# EAGLE schematic C1316G (EAGLE 6.6.0)
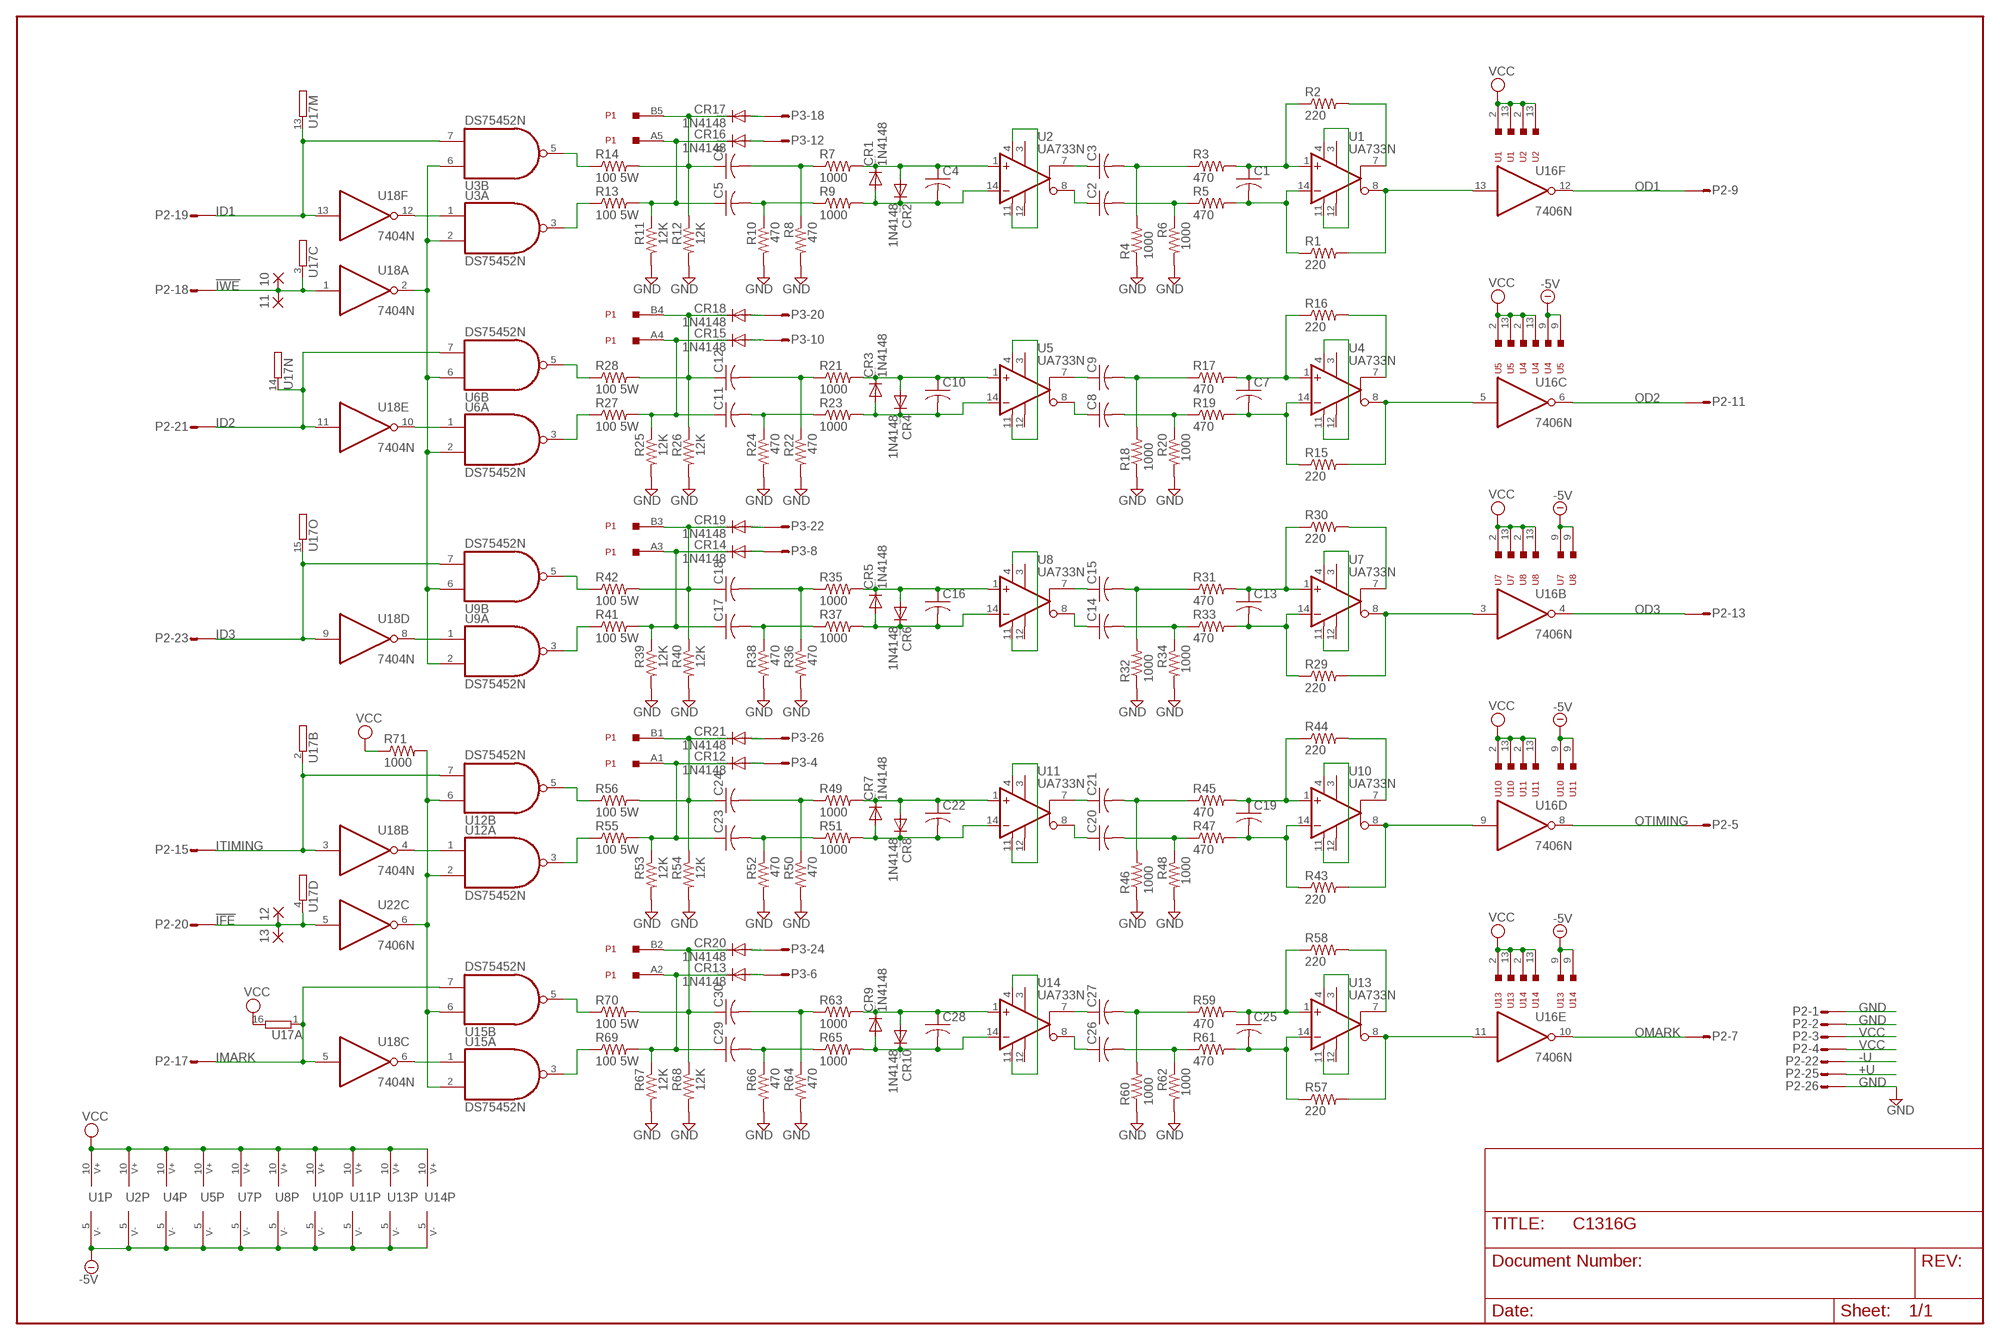
[diagram p0: schematic, sheet 1, part 1 of 2]
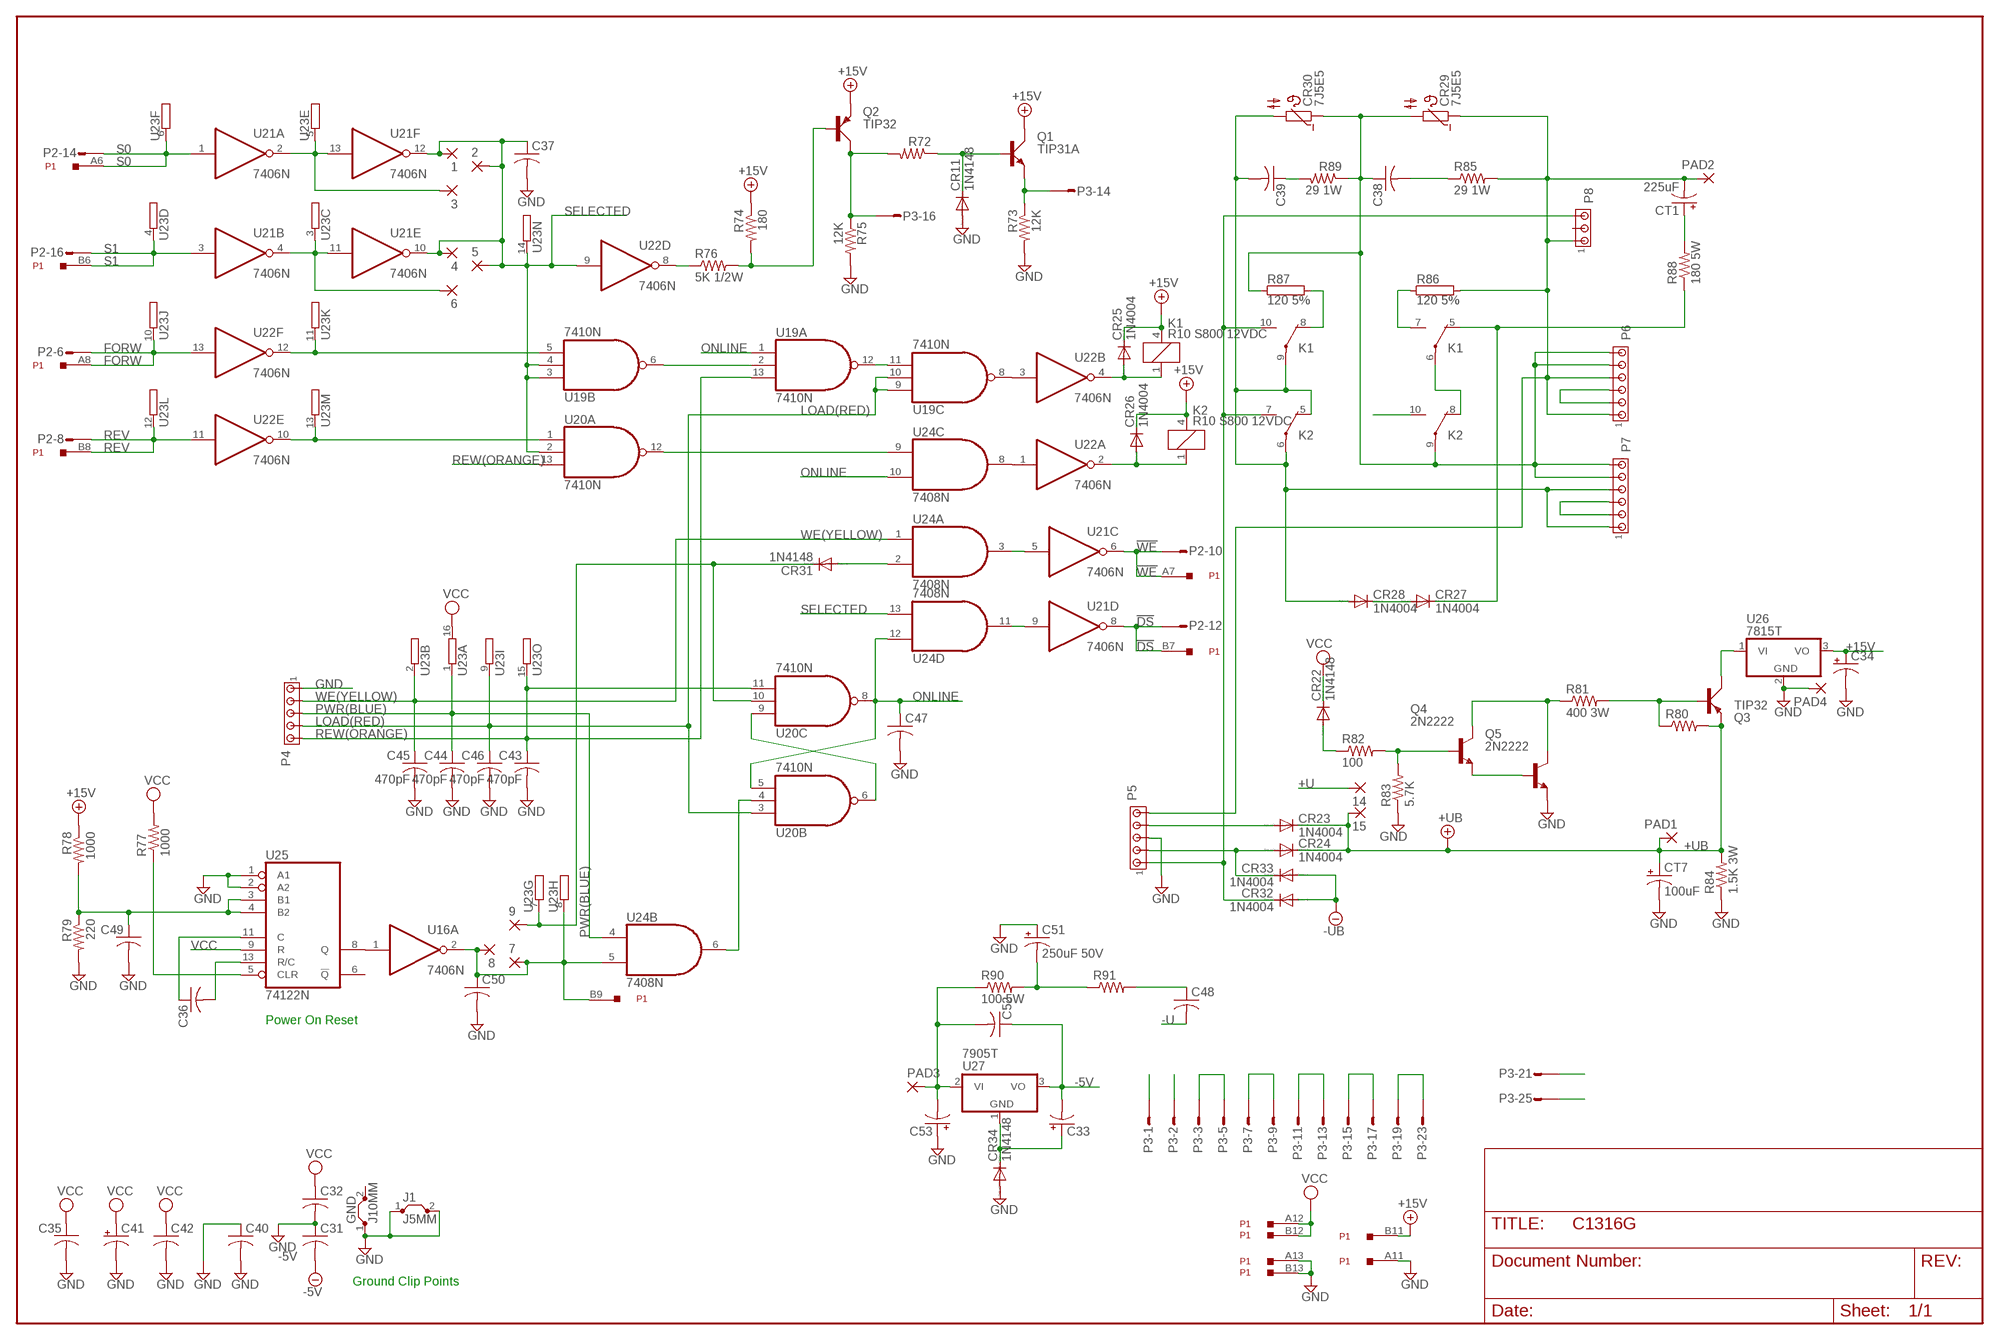
[diagram p1: schematic, sheet 1, part 2 of 2]

## Parts
1  1,6/0,8  [1,6/0,8]
2  1,6/0,8  [1,6/0,8]
3  1,6/0,8  [1,6/0,8]
4  1,6/0,8  [1,6/0,8]
5  1,6/0,8  [1,6/0,8]
6  1,6/0,8  [1,6/0,8]
7  1,6/0,8  [1,6/0,8]
8  1,6/0,8  [1,6/0,8]
9  1,6/0,8  [1,6/0,8]
10  1,6/0,8  [1,6/0,8]
11  1,6/0,8  [1,6/0,8]
12  1,6/0,8  [1,6/0,8]
13  1,6/0,8  [1,6/0,8]
14  1,6/0,8  [1,6/0,8]
15  1,6/0,8  [1,6/0,8]
C1  C-US102-043X133  [C102-043X133]
C2  C-US050-025X075  [C050-025X075]
C3  C-US050-025X075  [C050-025X075]
C4  C-US102-043X133  [C102-043X133]
C5  C-US050-025X075  [C050-025X075]
C6  C-US050-025X075  [C050-025X075]
C7  C-US102-043X133  [C102-043X133]
C8  C-US050-025X075  [C050-025X075]
C9  C-US050-025X075  [C050-025X075]
C10  C-US102-043X133  [C102-043X133]
C11  C-US050-025X075  [C050-025X075]
C12  C-US050-025X075  [C050-025X075]
C13  C-US102-043X133  [C102-043X133]
C14  C-US050-025X075  [C050-025X075]
C15  C-US050-025X075  [C050-025X075]
C16  C-US102-043X133  [C102-043X133]
C17  C-US050-025X075  [C050-025X075]
C18  C-US050-025X075  [C050-025X075]
C19  C-US102-043X133  [C102-043X133]
C20  C-US050-025X075  [C050-025X075]
C21  C-US050-025X075  [C050-025X075]
C22  C-US102-043X133  [C102-043X133]
C23  C-US050-025X075  [C050-025X075]
C24  C-US050-025X075  [C050-025X075]
C25  C-US102-043X133  [C102-043X133]
C26  C-US050-025X075  [C050-025X075]
C27  C-US050-025X075  [C050-025X075]
C28  C-US102-043X133  [C102-043X133]
C29  C-US050-025X075  [C050-025X075]
C30  C-US050-025X075  [C050-025X075]
C31  C-US050-025X075  [C050-025X075]
C32  C-US050-025X075  [C050-025X075]
C33  CPOL-USB45181B  [B45181B]
C34  CPOL-USB45181B  [B45181B]
C35  C-US050-025X075  [C050-025X075]
C36  C-US050-025X075  [C050-025X075]
C37  C-US050-025X075  [C050-025X075]
C38  C-US150-054X183  [C150-054X183]
C39  C-US150-054X183  [C150-054X183]
C40  C-US050-025X075  [C050-025X075]
C41  CPOL-USE22-6AXIAL  [E22-6]
C42  C-US050-025X075  [C050-025X075]
C43  470pF  C-US050-025X075  [C050-025X075]
C44  470pF  C-US050-025X075  [C050-025X075]
C45  470pF  C-US050-025X075  [C050-025X075]
C46  470pF  C-US050-025X075  [C050-025X075]
C47  C-US050-025X075  [C050-025X075]
C48  C-US050-025X075  [C050-025X075]
C49  C-US050-025X075  [C050-025X075]
C50  C-US102-043X133  [C102-043X133]
C51  250uF 50V  CPOL-USE35-12AXIAL  [E35-12]
C52  C-US050-025X075  [C050-025X075]
C53  CPOL-USE22-6AXIAL  [E22-6]
CR1  1N4148  1N4148DO35-10  [DO35-10]
CR2  1N4148  1N4148DO35-10  [DO35-10]
CR3  1N4148  1N4148DO35-10  [DO35-10]
CR4  1N4148  1N4148DO35-10  [DO35-10]
CR5  1N4148  1N4148DO35-10  [DO35-10]
CR6  1N4148  1N4148DO35-10  [DO35-10]
CR7  1N4148  1N4148DO35-10  [DO35-10]
CR8  1N4148  1N4148DO35-10  [DO35-10]
CR9  1N4148  1N4148DO35-10  [DO35-10]
CR10  1N4148  1N4148DO35-10  [DO35-10]
CR11  1N4148  1N4148DO35-10  [DO35-10]
CR12  1N4148  1N4148DO35-10  [DO35-10]
CR13  1N4148  1N4148DO35-10  [DO35-10]
CR14  1N4148  1N4148DO35-10  [DO35-10]
CR15  1N4148  1N4148DO35-10  [DO35-10]
CR16  1N4148  1N4148DO35-10  [DO35-10]
CR17  1N4148  1N4148DO35-10  [DO35-10]
CR18  1N4148  1N4148DO35-10  [DO35-10]
CR19  1N4148  1N4148DO35-10  [DO35-10]
CR20  1N4148  1N4148DO35-10  [DO35-10]
CR21  1N4148  1N4148DO35-10  [DO35-10]
CR22  1N4148  1N4148DO35-10  [DO35-10]
CR23  1N4004  [DO41-10]
CR24  1N4004  [DO41-10]
CR25  1N4004  [DO41-10]
CR26  1N4004  [DO41-10]
CR27  1N4004  [DO41-10]
CR28  1N4004  [DO41-10]
CR29  7J5E5  NTC644B  [N644B]
CR30  7J5E5  NTC644B  [N644B]
CR31  1N4148  1N4148DO35-10  [DO35-10]
CR32  1N4004  [DO41-10]
CR33  1N4004  [DO41-10]
CR34  1N4148  1N4148DO35-10  [DO35-10]
CT1  225uF  CPOL-USE55-25AXIAL  [E55-25]
CT7  100uF  CPOL-USE55-25AXIAL  [E55-25]
GND  J10MM  [10]
J1  J5MM  [05]
K1  R10 S800 12VDC  DPDTR10  [R10]
K2  R10 S800 12VDC  DPDTR10  [R10]
P1  EDGE13X2  [EDGE13X2]
P2  26HS  [26H]
P3  26VS  [26V]
P4  MTA05-156  [1X5MTA]
P5  MTA05-156  [1X5MTA]
P6  MTA06-156  [1X6MTA]
P7  MTA06-156  [1X6MTA]
P8  MTA03-156  [1X3MTA]
PAD1  3,81/1,1  [3,81/1,1]
PAD2  3,81/1,1  [3,81/1,1]
PAD3  1,6/0,8  [1,6/0,8]
PAD4  1,6/0,8  [1,6/0,8]
Q1  TIP31A  TIP41C  [TO220AV]
Q2  TIP32  TIP42C  [TO220AV]
Q3  TIP32  TIP42C  [TO220AV]
Q4  2N2222  2N2219  [TO5]
Q5  2N2222  2N2219  [TO5]
R1  220  R-US_0207/10  [0207/10]
R2  220  R-US_0207/10  [0207/10]
R3  470  R-US_0207/10  [0207/10]
R4  1000  R-US_0207/10  [0207/10]
R5  470  R-US_0207/10  [0207/10]
R6  1000  R-US_0207/10  [0207/10]
R7  1000  R-US_0207/10  [0207/10]
R8  470  R-US_0207/10  [0207/10]
R9  1000  R-US_0207/10  [0207/10]
R10  470  R-US_0207/10  [0207/10]
R11  12K  R-US_0207/10  [0207/10]
R12  12K  R-US_0207/10  [0207/10]
R13  100 5W  R-US_0414/20  [0414/20]
R14  100 5W  R-US_0414/20  [0414/20]
R15  220  R-US_0207/10  [0207/10]
R16  220  R-US_0207/10  [0207/10]
R17  470  R-US_0207/10  [0207/10]
R18  1000  R-US_0207/10  [0207/10]
R19  470  R-US_0207/10  [0207/10]
R20  1000  R-US_0207/10  [0207/10]
R21  1000  R-US_0207/10  [0207/10]
R22  470  R-US_0207/10  [0207/10]
R23  1000  R-US_0207/10  [0207/10]
R24  470  R-US_0207/10  [0207/10]
R25  12K  R-US_0207/10  [0207/10]
R26  12K  R-US_0207/10  [0207/10]
R27  100 5W  R-US_0414/20  [0414/20]
R28  100 5W  R-US_0414/20  [0414/20]
R29  220  R-US_0207/10  [0207/10]
R30  220  R-US_0207/10  [0207/10]
R31  470  R-US_0207/10  [0207/10]
R32  1000  R-US_0207/10  [0207/10]
R33  470  R-US_0207/10  [0207/10]
R34  1000  R-US_0207/10  [0207/10]
R35  1000  R-US_0207/10  [0207/10]
R36  470  R-US_0207/10  [0207/10]
R37  1000  R-US_0207/10  [0207/10]
R38  470  R-US_0207/10  [0207/10]
R39  12K  R-US_0207/10  [0207/10]
R40  12K  R-US_0207/10  [0207/10]
R41  100 5W  R-US_0414/20  [0414/20]
R42  100 5W  R-US_0414/20  [0414/20]
R43  220  R-US_0207/10  [0207/10]
R44  220  R-US_0207/10  [0207/10]
R45  470  R-US_0207/10  [0207/10]
R46  1000  R-US_0207/10  [0207/10]
R47  470  R-US_0207/10  [0207/10]
R48  1000  R-US_0207/10  [0207/10]
R49  1000  R-US_0207/10  [0207/10]
R50  470  R-US_0207/10  [0207/10]
R51  1000  R-US_0207/10  [0207/10]
R52  470  R-US_0207/10  [0207/10]
R53  12K  R-US_0207/10  [0207/10]
R54  12K  R-US_0207/10  [0207/10]
R55  100 5W  R-US_0414/20  [0414/20]
R56  100 5W  R-US_0414/20  [0414/20]
R57  220  R-US_0207/10  [0207/10]
R58  220  R-US_0207/10  [0207/10]
R59  470  R-US_0207/10  [0207/10]
R60  1000  R-US_0207/10  [0207/10]
R61  470  R-US_0207/10  [0207/10]
R62  1000  R-US_0207/10  [0207/10]
R63  1000  R-US_0207/10  [0207/10]
R64  470  R-US_0207/10  [0207/10]
R65  1000  R-US_0207/10  [0207/10]
R66  470  R-US_0207/10  [0207/10]
R67  12K  R-US_0207/10  [0207/10]
R68  12K  R-US_0207/10  [0207/10]
R69  100 5W  R-US_0414/20  [0414/20]
R70  100 5W  R-US_0414/20  [0414/20]
R71  1000  R-US_0207/10  [0207/10]
R72  R-US_0207/10  [0207/10]
R73  12K  R-US_0207/10  [0207/10]
R74  180  R-US_0207/10  [0207/10]
R75  12K  R-US_0207/10  [0207/10]
R76  5K 1/2W  R-US_0411/15  [0411/15]
R77  1000  R-US_0207/10  [0207/10]
R78  1000  R-US_0207/10  [0207/10]
R79  220  R-US_0207/10  [0207/10]
R80  R-US_0207/10  [0207/10]
R81  400 3W  R-US_0617/22  [0617/22]
R82  100  R-US_0207/10  [0207/10]
R83  5.7K  R-US_0207/10  [0207/10]
R84  1.5K 3W  R-US_0414/20  [0414/20]
R85  29 1W  R-US_0411/15  [0411/15]
R86  120 5%  RKH216-8  [KH216-8]
R87  120 5%  RKH216-8  [KH216-8]
R88  180 5W  R-US_0414/20  [0414/20]
R89  29 1W  R-US_0411/15  [0411/15]
R90  100 5W  R-US_0414/20  [0414/20]
R91  R-US_0207/10  [0207/10]
U1  UA733N  [DIL14]
U2  UA733N  [DIL14]
U3  DS75452N  [DIL08]
U4  UA733N  [DIL14]
U5  UA733N  [DIL14]
U6  DS75452N  [DIL08]
U7  UA733N  [DIL14]
U8  UA733N  [DIL14]
U9  DS75452N  [DIL08]
U10  UA733N  [DIL14]
U11  UA733N  [DIL14]
U12  DS75452N  [DIL08]
U13  UA733N  [DIL14]
U14  UA733N  [DIL14]
U15  DS75452N  [DIL08]
U16  7406N  [DIL14]
U17  E15R  [DIL16]
U18  7404N  [DIL14]
U19  7410N  [DIL14]
U20  7410N  [DIL14]
U21  7406N  [DIL14]
U22  7406N  [DIL14]
U23  E15R  [DIL16]
U24  7408N  74LS08N  [DIL14]
U25  74122N  74LS122N  [DIL14]
U26  7815T  7805T  [TO220H]
U27  7905T  [TO220H]

## Nets
!DS: P1.B7 P2.12 U21.8(D:O)
!IFE: 12.1(P) 13.1(P) P2.20 U17.4 U22.5(C:I)
!IWE: 10.1(P) 11.1(P) P2.18 U17.3 U18.1(A:I)
!WE: P1.A7 P2.10 U21.6(C:O)
+15V: C34.+ CR25.C CR26.C K1.4 K2.4 P1.B11 Q1.C Q2.E R74.1 R78.1 U26.3(VO)
+U: 14.1(P) P2.25
+UB: 15.1(P) CR23.C CR24.C CT7.+ PAD1.1(P) Q3.E R80.2 R84.2
-5V: C31.2 C33.- C52.1 U1.5(V-) U2.5(V-) U4.5(V-) U4.9 U5.5(V-) U5.9 U7.5(V-) U7.9 U8.5(V-) U8.9 U10.5(V-) U10.9 U11.5(V-) U11.9 U13.5(V-) U13.9 U14.5(V-) U14.9 U27.3(VO)
-U: C48.2 P2.22
-UB: CR32.A CR33.A
FORW: P1.A8 P2.6 U22.13(F:I) U23.10
GND: C31.1 C32.2 C34.- C35.2 C37.2 C40.1 C40.2 C41.- C42.2 C43.2 C44.2 C45.2 C46.2 C47.2 C49.2 C50.2 C51.+ C53.+ CR11.A CR34.A CT7.- GND.1 J1.1 J1.2 P1.A11 P1.A13 P1.B13 P2.1 P2.2 P2.26 P4.1 P5.3 PAD4.1(P) Q5.1(E) R4.1 R6.2 R8.2 R10.2 R11.2 R12.2 R18.1 R20.2 R22.2 R24.2 R25.2 R26.2 R32.1 R34.2 R36.2 R38.2 R39.2 R40.2 R46.1 R48.2 R50.2 R52.2 R53.2 R54.2 R60.1 R62.2 R64.2 R66.2 R67.2 R68.2 R73.2 R75.2 R79.2 R83.1 R84.1 U25.1(A1) U25.2(A2) U26.2(GND)
ID1: P2.19 U3.7(B:I1) U17.13 U18.13(F:I)
ID2: P2.21 U6.7(B:I1) U17.14 U18.11(E:I)
ID3: P2.23 U9.7(B:I1) U17.15 U18.9(D:I)
IMARK: P2.17 U15.7(B:I1) U17.1 U18.5(C:I)
ITIMING: P2.15 U12.7(B:I1) U17.2 U18.3(B:I)
K1: CR25.A K1.1 U22.4(B:O)
K2: CR26.A K2.1 U22.2(A:O)
LOAD(RED): C46.1 P4.4 U19.9(C:I0) U19.10(C:I1) U20.3(B:I0) U23.9
N$2: C13.2 R29.1 R33.2 U7.14(-IN)
N$3: R29.2 U7.8(OUT-) U16.3(B:I)
N$4: C13.1 R30.1 R31.2 U7.1(+IN)
N$5: R30.2 U7.7(OUT+)
N$6: C15.2 R31.1 R32.2
N$7: C14.2 R33.1 R34.1
N$8: C16.1 CR5.C CR6.A R35.2 U8.1(+IN)
N$9: C17.2 R37.1 R38.1
N$10: C16.2 CR5.A CR6.C R37.2 U8.14(-IN)
N$11: R41.1 U9.3(A:O)
N$12: C1.2 R1.1 R5.2 U1.14(-IN)
N$13: R1.2 U1.8(OUT-) U16.13(F:I)
N$14: C1.1 R2.1 R3.2 U1.1(+IN)
N$15: R2.2 U1.7(OUT+)
N$16: C6.2 R7.1 R8.1
N$17: C3.2 R3.1 R4.2
N$18: U21.9(D:I) U24.11(D:O)
N$19: C6.1 CR17.C P1.B5 R12.1 R14.2
N$20: C2.2 R5.1 R6.1
N$21: C5.1 CR16.C P1.A5 R11.1 R13.2
N$22: CR32.C K1.10(U2:S) K2.7(U1:S) P5.1 P8.3
N$23: CR29.1 CT1.- P5.5 P6.1 P6.4 P8.1 PAD2.1(P) R85.2 R86.2
N$24: C4.1 CR1.C CR2.A R7.2 U2.1(+IN)
N$25: CR23.A P5.4
N$26: C7.2 R15.1 R19.2 U4.14(-IN)
N$27: CR24.A CR33.C P5.2
N$28: C5.2 R9.1 R10.1
N$29: C4.2 CR1.A CR2.C R9.2 U2.14(-IN)
N$30: R15.2 U4.8(OUT-) U16.5(C:I)
N$31: C7.1 R16.1 R17.2 U4.1(+IN)
N$33: R16.2 U4.7(OUT+)
N$34: Q2.B R74.2 R76.2
N$35: C9.2 R17.1 R18.2
N$36: R13.1 U3.3(A:O)
N$38: R14.1 U3.5(B:O)
N$39: P3.1
N$40: C8.2 R19.1 R20.1
N$41: C10.1 CR3.C CR4.A R21.2 U5.1(+IN)
N$42: C11.2 R23.1 R24.1
N$43: C10.2 CR3.A CR4.C R23.2 U5.14(-IN)
N$44: R27.1 U6.3(A:O)
N$45: U1.4(GA1) U1.11(GB1)
N$46: R28.1 U6.5(B:O)
N$47: U4.4(GA1) U4.11(GB1)
N$48: U5.4(GA1) U5.11(GB1)
N$49: C9.1 U5.7(OUT+)
N$50: C8.1 U5.8(OUT-)
N$51: U3.2(A:I1) U3.6(B:I0) U6.2(A:I1) U6.6(B:I0) U9.2(A:I1) U9.6(B:I0) U18.2(A:O)
N$52: U6.1(A:I0) U18.10(E:O)
N$53: U2.4(GA1) U2.11(GB1)
N$54: P3.2
N$55: C12.2 R21.1 R22.1
N$56: C11.1 CR15.C P1.A4 R25.1 R27.2
N$57: C12.1 CR18.C P1.B4 R26.1 R28.2
N$58: C3.1 U2.7(OUT+)
N$59: C2.1 U2.8(OUT-)
N$60: C23.1 CR12.C P1.A1 R53.1 R55.2
N$61: U3.1(A:I0) U18.12(F:O)
N$62: P3.3 P3.5
N$63: CR12.A P3.4
N$64: R42.1 U9.5(B:O)
N$66: CR13.A P3.6
N$67: R43.2 U10.8(OUT-) U16.9(D:I)
N$68: R57.2 U13.8(OUT-) U16.11(E:I)
N$69: U7.4(GA1) U7.11(GB1)
N$70: U8.4(GA1) U8.11(GB1)
N$71: U12.1(A:I0) U18.4(B:O)
N$72: U15.1(A:I0) U18.6(C:O)
N$73: U9.1(A:I0) U18.8(D:O)
N$74: P3.7 P3.9
N$75: CR14.A P3.8
N$76: Q4.3(C) Q5.3(C) R81.1
N$77: CR15.A P3.10
N$78: 7.1(P) 8.1(P) C50.1 P1.B9 U16.2(A:O) U23.8 U24.5(B:I1)
N$79: P3.11 P3.13
N$80: CR16.A P3.12
N$81: CR11.C Q1.B R72.1
N$82: P3.14 Q1.E R73.1
N$83: C15.1 U8.7(OUT+)
N$84: C14.1 U8.8(OUT-)
N$85: R76.1 U22.8(D:O)
N$87: 6.1(P) U21.4(B:O) U21.11(E:I) U23.3
N$88: C18.2 R35.1 R36.1
N$89: C17.1 CR14.C P1.A3 R39.1 R41.2
N$90: C18.1 CR19.C P1.B3 R40.1 R42.2
N$91: C39.1 R89.2
N$92: C19.2 R43.1 R47.2 U10.14(-IN)
N$93: P3.15 P3.17
N$94: C19.1 R44.1 R45.2 U10.1(+IN)
N$95: R44.2 U10.7(OUT+)
N$96: C21.2 R45.1 R46.2
N$97: C20.2 R47.1 R48.1
N$98: C22.1 CR7.C CR8.A R49.2 U11.1(+IN)
N$99: C23.2 R51.1 R52.1
N$100: C22.2 CR7.A CR8.C R51.2 U11.14(-IN)
N$101: R55.1 U12.3(A:O)
N$102: R56.1 U12.5(B:O)
N$103: U10.4(GA1) U10.11(GB1)
N$104: U11.4(GA1) U11.11(GB1)
N$105: C21.1 U11.7(OUT+)
N$106: C20.1 U11.8(OUT-)
N$107: R71.2 U12.2(A:I1) U12.6(B:I0) U15.2(A:I1) U15.6(B:I0) U22.6(C:O)
N$108: U21.5(C:I) U24.3(A:O)
N$109: U19.8(C:O) U22.3(B:I)
N$110: C24.2 R49.1 R50.1
N$111: C48.1 R91.2
N$112: C24.1 CR21.C P1.B1 R54.1 R56.2
N$113: 3.1(P) U21.2(A:O) U21.13(F:I) U23.5
N$114: C25.2 R57.1 R61.2 U13.14(-IN)
N$115: P3.16 Q2.C R72.2 R75.1
N$116: C25.1 R58.1 R59.2 U13.1(+IN)
N$117: R58.2 U13.7(OUT+)
N$118: C27.2 R59.1 R60.2
N$119: C26.2 R61.1 R62.1
N$120: C28.1 CR9.C CR10.A R63.2 U14.1(+IN)
N$121: C29.2 R65.1 R66.1
N$122: C28.2 CR9.A CR10.C R65.2 U14.14(-IN)
N$123: R69.1 U15.3(A:O)
N$124: R70.1 U15.5(B:O)
N$125: U13.4(GA1) U13.11(GB1)
N$126: U14.4(GA1) U14.11(GB1)
N$127: C27.1 U14.7(OUT+)
N$128: C26.1 U14.8(OUT-)
N$130: C38.1 CR29.2 CR30.1 K2.9(U2:P) P6.5 P6.6 P7.5 P7.6 R87.1 R89.1
N$132: C30.2 R63.1 R64.1
N$133: C29.1 CR13.C P1.A2 R67.1 R69.2
N$134: C30.1 CR20.C P1.B2 R68.1 R70.2
N$136: U19.5(B:I2) U22.12(F:O) U23.11
N$137: U22.1(A:I) U24.8(C:O)
N$139: 9.1(P) CR31.C U20.10(C:I1) U23.7
N$141: P3.21
N$142: C33.+ CR34.C U27.1(GND)
N$144: U20.1(A:I0) U22.10(E:O) U23.13
N$146: CR19.A P3.22
N$147: C52.2 C53.- PAD3.1(P) R90.1 U27.2(VI)
N$149: Q3.C U26.1(VI)
N$152: Q3.B R80.1 R81.2
N$153: U19.2(A:I1) U19.6(B:O)
N$155: Q4.1(E) Q5.2(B)
N$156: Q4.2(B) R82.2 R83.2
N$157: C51.- R90.2 R91.1
N$158: C38.2 R85.1
N$159: U19.11(C:I2) U19.12(A:O)
N$161: U20.12(A:O) U24.9(C:I0)
N$163: U20.4(B:I1) U24.6(B:O)
N$164: CR27.C K1.5(U1:O) R88.1
N$165: U20.6(B:O) U20.9(C:I0)
N$166: C49.1 R78.2 R79.1 U25.3(B1) U25.4(B2)
N$175: CR22.A R82.1
N$178: C39.2 CR28.A CR30.2 K1.9(U2:P) K2.5(U1:O) K2.6(U1:P) P7.1 P7.4
N$179: K1.7(U1:S) R86.1
N$183: CR31.A U24.2(A:I1)
N$184: C36.2 U25.13(R/C)
N$189: C36.1 U25.11(C)
N$191: R77.1 U25.5(CLR)
N$192: U16.1(A:I) U25.8(Q)
N$196: P6.2 P6.3
N$197: P7.2 P7.3
N$199: P3.19 P3.23
N$201: CR20.A P3.24
N$202: P3.25
N$203: CR21.A P3.26
N$205: CR17.A P3.18
N$207: CR18.A P3.20
N$211: K1.8(U2:O) R87.2
N$215: CT1.+ R88.2
N$222: CR27.A CR28.C
N$227: K1.6(U1:P) K2.8(U2:O)
N$231: K2.10(U2:S)
OD1: P2.9 U16.12(F:O)
OD2: P2.11 U16.6(C:O)
OD3: P2.13 U16.4(B:O)
OMARK: P2.7 U16.10(E:O)
ONLINE: C47.1 U19.1(A:I0) U20.5(B:I2) U20.8(C:O) U24.10(C:I1) U24.12(D:I0)
OTIMING: P2.5 U16.8(D:O)
PWR(BLUE): C44.1 P4.3 U23.1 U24.4(B:I0)
REV: P1.B8 P2.8 U22.11(E:I) U23.12
REW(ORANGE): C43.1 P4.5 U19.13(A:I2) U20.11(C:I2) U20.13(A:I2) U23.15
S0: P1.A6 P2.14 U21.1(A:I) U23.6
S1: P1.B6 P2.16 U21.3(B:I) U23.4
SELECTED: 1.1(P) 2.1(P) 4.1(P) 5.1(P) C37.1 U19.3(B:I0) U19.4(B:I1) U20.2(A:I1) U21.10(E:O) U21.12(F:O) U22.9(D:I) U23.14 U24.13(D:I1)
VCC: C32.1 C35.1 C41.+ C42.1 CR22.C P1.A12 P1.B12 P2.3 P2.4 R71.1 R77.2 U1.2 U1.10(V+) U1.13 U2.2 U2.10(V+) U2.13 U4.2 U4.10(V+) U4.13 U5.2 U5.10(V+) U5.13 U7.2 U7.10(V+) U7.13 U8.2 U8.10(V+) U8.13 U10.2 U10.10(V+) U10.13 U11.2 U11.10(V+) U11.13 U13.2 U13.10(V+) U13.13 U14.2 U14.10(V+) U14.13 U17.16 U23.16 U25.9(R)
WE(YELLOW): C45.1 P4.2 U23.2 U24.1(A:I0)
Unconnected: GND.2 P1.A9 P1.A10 P1.B10 P2.24 P8.2 U1.3(GA2) U1.6 U1.9 U1.12(GB2) U2.3(GA2) U2.6 U2.9 U2.12(GB2) U4.3(GA2) U4.6 U4.12(GB2) U5.3(GA2) U5.6 U5.12(GB2) U7.3(GA2) U7.6 U7.12(GB2) U8.3(GA2) U8.6 U8.12(GB2) U10.3(GA2) U10.6 U10.12(GB2) U11.3(GA2) U11.6 U11.12(GB2) U13.3(GA2) U13.6 U13.12(GB2) U14.3(GA2) U14.6 U14.12(GB2) U17.5 U17.6 U17.7 U17.8 U17.9 U17.10 U17.11 U17.12 U25.6(!Q)

## Notes on the sheet
- Power On Reset
- Ground Clip Points

## Power pins joined to a net without a drawn wire
GND: U3.4(P:GND) U6.4(P:GND) U9.4(P:GND) U12.4(P:GND) U15.4(P:GND) U16.7(P:GND) U18.7(P:GND) U19.7(P:GND) U20.7(P:GND) U21.7(P:GND) U22.7(P:GND) U24.7(P:GND) U25.7(GND)
VCC: U3.8(P:VCC) U6.8(P:VCC) U9.8(P:VCC) U12.8(P:VCC) U15.8(P:VCC) U16.14(P:VCC) U18.14(P:VCC) U19.14(P:VCC) U20.14(P:VCC) U21.14(P:VCC) U22.14(P:VCC) U24.14(P:VCC) U25.14(VCC)

## Library data of the parts
1-15 PAD3 PAD4 = wirepad:1,6/0,8: THROUGH-HOLE PAD
C1-C32 C35-C40 C42-C50 C52 = rcl:C-US: CAPACITOR, American symbol
C33 C34 C41 C51 C53 CT1 CT7 = rcl:CPOL-US: POLARIZED CAPACITOR, American symbol
CR1-CR22 CR31 CR34 = diode:1N4148: DIODE high speed (Philips)
CR23-CR28 CR32 CR33 = diode:1N4004: DIODE general purpose rectifier, 1 A
CR29 CR30 = ptc-ntc:NTC644B: PHILIPS NTC; OC_FARNELL: unknown; OC_NEWARK: unknown
GND J1 = jumper:J: Bridge
K1 K2 = dec-con:DPDTR10: DPDT Relay
P1 = dec-con:EDGE13X2: 13x2 Keyed Edge Connector
P2 = con-harting-h:26HS: CONNECTOR; OC_FARNELL: unknown; OC_NEWARK: unknown
P3 = con-harting-v:26VS: CONNECTOR; OC_FARNELL: unknown; OC_NEWARK: unknown
P4 P5 = con-amp:MTA05-156: AMP connector
P6 P7 = con-amp:MTA06-156: AMP connector
P8 = con-amp:MTA03-156: AMP connector
PAD1 PAD2 = wirepad:3,81/1,1: THROUGH-HOLE PAD
Q1 = transistor-power:TIP41C: NPN TRANSISTOR
Q2 Q3 = transistor-power:TIP42C: PNP TRANSISTOR
Q4 Q5 = transistor-npn:2N2219: NPN Transistor
R1-R12 R15-R26 R29-R40 R43-R54 R57-R68 R71-R83 R85 R89 R91 = rcl:R-US_: RESISTOR, American symbol
R13 R14 R27 R28 R41 R42 R55 R56 R69 R70 R84 R88 R90 = dec-con:R-US_0414/20: 0.8" Resistor
R86 R87 = resistor-power:R: Power Resitor; OC_FARNELL: unknown; OC_NEWARK: unknown
U1 U2 U4 U5 U7 U8 U10 U11 U13 U14 = dec-con:UA733N: Differential Op Amp with gain adjust
U3 U6 U9 U12 U15 = dec-con:DS75452: Quad 2-input NAND gate, open collector output
U16 U21 U22 = 74xx-us:74*06: Hex INVERTER, open collector high-voltage output
U17 U23 = resistor-dil:E15R: DIL RESISTOR; OC_FARNELL: unknown; OC_NEWARK: unknown
U18 = 74xx-us:74*04: Hex INVERTER
U19 U20 = 74xx-us:74*10: Triple 3-input NAND gate
U24 = 74xx-us:74*08: Quad 2-input AND gate
U25 = 74xx-us:74*122: Retriggerable monostable MULTIVIBRATOR
U26 = linear:78*: Positive VOLTAGE REGULATOR Source: http://cache.national.com/ds/LM/LM78L05.pdf http://www.fairchildsemi.com/ds/LM/LM7805.pdf
U27 = linear:79*: Negative VOLTAGE REGULATOR